# Altium schematic sheet Glucometer-I.C.- RF Module V2.SchDoc
size Letter
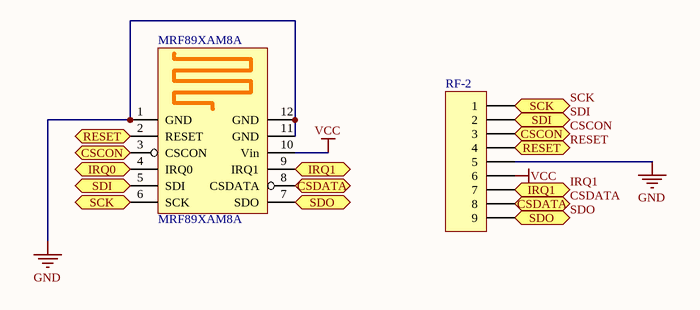
[diagram p0: Glucometer-I.C.- RF Module V2.SchDoc]

## Parts
MRF89XAM8A  MRF89XAM8A  [MRF89XAM8A]
RF-2  Header 9  [HDR1X9]  (value not drawn)

## Ports
CSCON, CSDATA, IRQ0, IRQ1, RESET, SCK, SDI, SDO

## Nets
GND: MRF89XAM8A.1(GND) MRF89XAM8A.11(GND) MRF89XAM8A.12(GND) RF-2.5
VCC: MRF89XAM8A.10(Vin) RF-2.6
CSCON: MRF89XAM8A.3(CSCON) RF-2.3 ; port CSCON
CSDATA: MRF89XAM8A.8(CSDATA) RF-2.8 ; port CSDATA
IRQ0: MRF89XAM8A.4(IRQ0) ; port IRQ0
IRQ1: MRF89XAM8A.9(IRQ1) RF-2.7 ; port IRQ1
RESET: MRF89XAM8A.2(RESET) RF-2.4 ; port RESET
SCK: MRF89XAM8A.6(SCK) RF-2.1 ; port SCK
SDI: MRF89XAM8A.5(SDI) RF-2.2 ; port SDI
SDO: MRF89XAM8A.7(SDO) RF-2.9 ; port SDO

## Library data of the parts
MRF89XAM8A = MRF89XAM8A: RF Module. 868MHz Ultra Low Power Sub-Ghz Transceiver Module
RF-2 = Header 9: Header, 9-Pin; LatestRevisionDate: 17-Jul-2002; LatestRevisionNote: Re-released for DXP Platform.; Publisher: Altium Limited